# EAGLE design maho-messure (EAGLE 4.16)
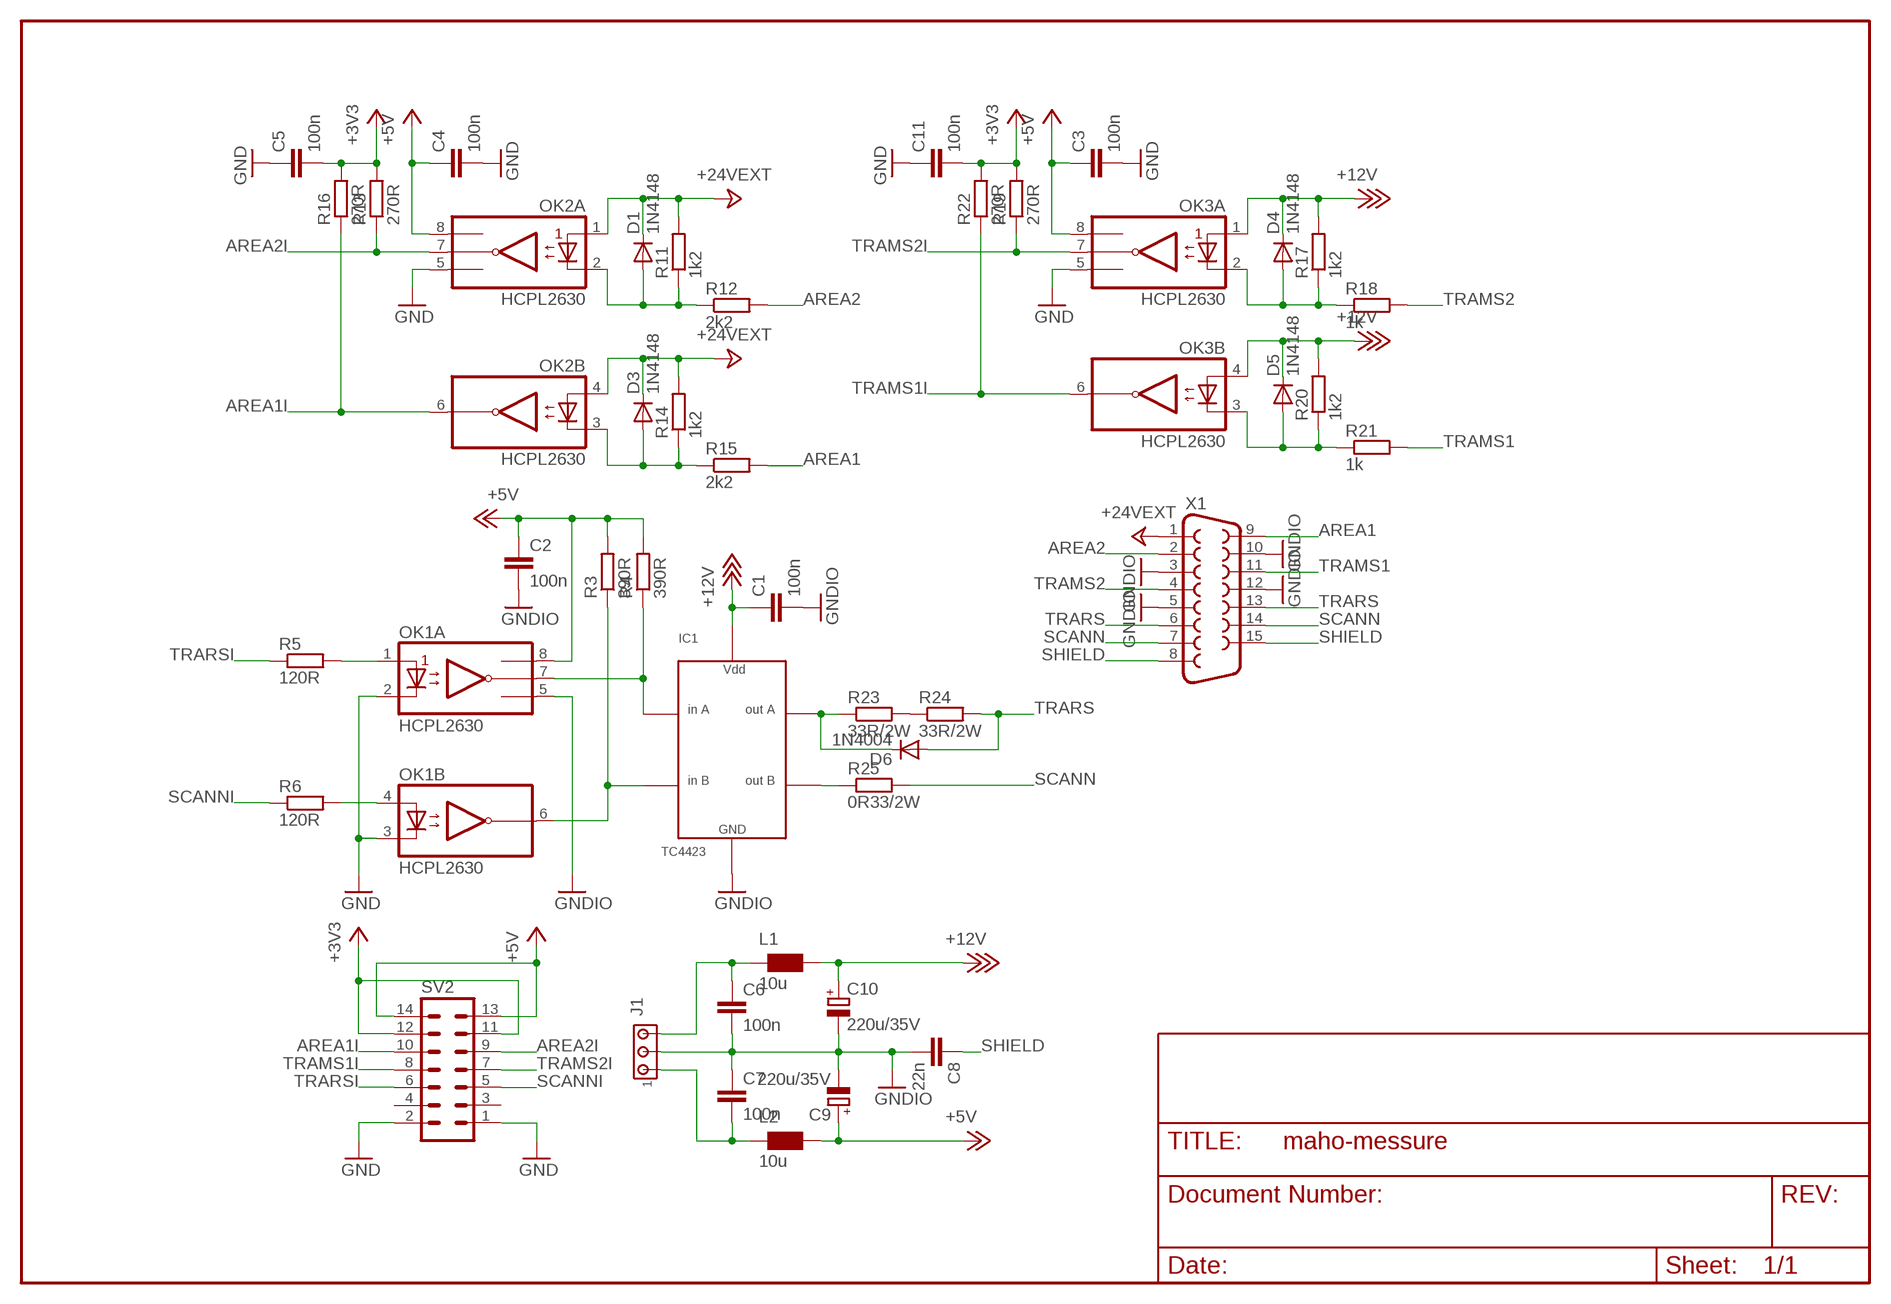
[diagram p0: schematic, sheet 1]

## Parts
C1  100n  C-EUC0603  [C0603]
C2  100n  C-EUC0603  [C0603]
C3  100n  C-EUC0603  [C0603]
C4  100n  C-EUC0603  [C0603]
C5  100n  C-EUC0603  [C0603]
C6  100n  C-EUC0603  [C0603]
C7  100n  C-EUC0603  [C0603]
C8  22n  C-EUC0603  [C0603]
C9  220u/35V  CPOL-EUF  [PANASONIC_F]
C10  220u/35V  CPOL-EUF  [PANASONIC_F]
C11  100n  C-EUC0603  [C0603]
D1  1N4148  DIODE-MINIMELF  [MINIMELF]
D3  1N4148  DIODE-MINIMELF  [MINIMELF]
D4  1N4148  DIODE-MINIMELF  [MINIMELF]
D5  1N4148  DIODE-MINIMELF  [MINIMELF]
D6  1N4004  ES2D  [SMB]
IC1  TC4423  TC442X  [SO08]
J1  MTA03-100  [10X03MTA]
L1  10u  WE-HC_744312...  [WE-HC_744312...]
L2  10u  WE-HC_744312...  [WE-HC_744312...]
OK1  HCPL2630  [DIL08]
OK2  HCPL2630  [DIL08]
OK3  HCPL2630  [DIL08]
R3  390R  R-EU_R0805  [R0805]
R4  390R  R-EU_R0805  [R0805]
R5  120R  R-EU_R0805  [R0805]
R6  120R  R-EU_R0805  [R0805]
R11  1k2  R-EU_R0805  [R0805]
R12  2k2  R-EU_R0805  [R0805]
R13  270R  R-EU_R0805  [R0805]
R14  1k2  R-EU_R0805  [R0805]
R15  2k2  R-EU_R0805  [R0805]
R16  270R  R-EU_R0805  [R0805]
R17  1k2  R-EU_R0805  [R0805]
R18  1k  R-EU_R0805  [R0805]
R19  270R  R-EU_R0805  [R0805]
R20  1k2  R-EU_R0805  [R0805]
R21  1k  R-EU_R0805  [R0805]
R22  270R  R-EU_R0805  [R0805]
R23  33R/2W  R-EU_R2512  [R2512]
R24  33R/2W  R-EU_R2512  [R2512]
R25  0R33/2W  R-EU_R2512  [R2512]
SV2  ML14  [ML14]
X1  F15HP  [F15HP]

## Nets
+3V3: C5.2 C11.2 R13.2 R16.2 R19.2 R22.2 SV2.11 SV2.12
+5V: C3.1 C4.1 OK2.8(A:VCC) OK3.8(A:VCC) SV2.13 SV2.14
+12V: C2.1 C9.+ L2.2 OK1.8(A:VCC) R3.2 R4.2 ; supply symbol labelled +5V
+18V: C1.1 C10.+ D4.C D5.C IC1.6(VDD) L1.2 OK3.1(A:A1) OK3.4(B:A2) R17.2 R20.2 ; supply symbol labelled +12V
+24V: D1.C D3.C OK2.1(A:A1) OK2.4(B:A2) R11.2 R14.2 X1.1 ; supply symbol labelled +24VEXT
AREA1: R15.2 X1.9
AREA1I: OK2.6(B:VO2) R16.1 SV2.10
AREA2: R12.2 X1.2
AREA2I: OK2.7(A:VO1) R13.1 SV2.9
GND: C3.2 C4.2 C5.1 C11.1 OK1.2(A:C1) OK1.3(B:C2) OK2.5(A:GND) OK3.5(A:GND) SV2.1 SV2.2
GNDIO: C1.2 C2.2 C6.2 C7.1 C8.2 C9.- C10.- IC1.3(GND) J1.2 OK1.5(A:GND) X1.3 X1.5 X1.10 X1.12
N$1: D6.C IC1.7(OUT_A) R23.1
N$2: IC1.5(OUT_B) R25.1
N$3: IC1.2(IN_A) OK1.7(A:VO1) R4.1
N$4: IC1.4(IN_B) OK1.6(B:VO2) R3.1
N$5: C7.2 J1.1 L2.1
N$6: OK1.1(A:A1) R5.2
N$7: OK1.4(B:A2) R6.2
N$9: D1.A OK2.2(A:C1) R11.1 R12.1
N$15: C6.1 J1.3 L1.1
N$16: D3.A OK2.3(B:C2) R14.1 R15.1
N$17: R23.2 R24.1
N$21: D4.A OK3.2(A:C1) R17.1 R18.1
N$24: D5.A OK3.3(B:C2) R20.1 R21.1
SCANN: R25.2 X1.7 X1.14
SCANNI: R6.1 SV2.5
SHIELD: C8.1 X1.8 X1.15
TRAMS1: R21.2 X1.11
TRAMS1I: OK3.6(B:VO2) R22.1 SV2.8
TRAMS2: R18.2 X1.4
TRAMS2I: OK3.7(A:VO1) R19.1 SV2.7
TRARS: D6.A R24.2 X1.6 X1.13
TRARSI: R5.1 SV2.6
Unconnected: SV2.3 SV2.4

## Library data of the parts
C1-C8 C11 = rcl:C-EU: CAPACITOR, European symbol
C9 C10 = rcl:CPOL-EU: POLARIZED CAPACITOR, European symbol
D1 D3-D5 = diode:DIODE-: DIODE
D6 = diode:ES2D: DIODE super fast rectifier, 2 A
IC1 = sascha_micro:TC442X
J1 = con-amp:MTA03-100: AMP connector
L1 L2 = wuerth-elektronik:WE-HC: SMD-Flat Wire Inductors WE-HC HIGH CURRENT Lower losses and no thermal aging because of the new advanced core material Superflux 200 - Flat wire coil for lower losses at high frequency ranges - Low leakage field - Extremely low profile design - Current loading up to 30 A -- Graphic cards -- Laptops -- Motherboards -- High current switching regulators -- Automotive electronics
OK1-OK3 = optocoupler:HCPL2630: HEWLETT PACKARD OPTO COUPLER
R3-R6 R11-R25 = rcl:R-EU_: RESISTOR, European symbol
SV2 = con-harting-ml:ML14: HARTING
X1 = con-subd:F15: SUB-D

## Board
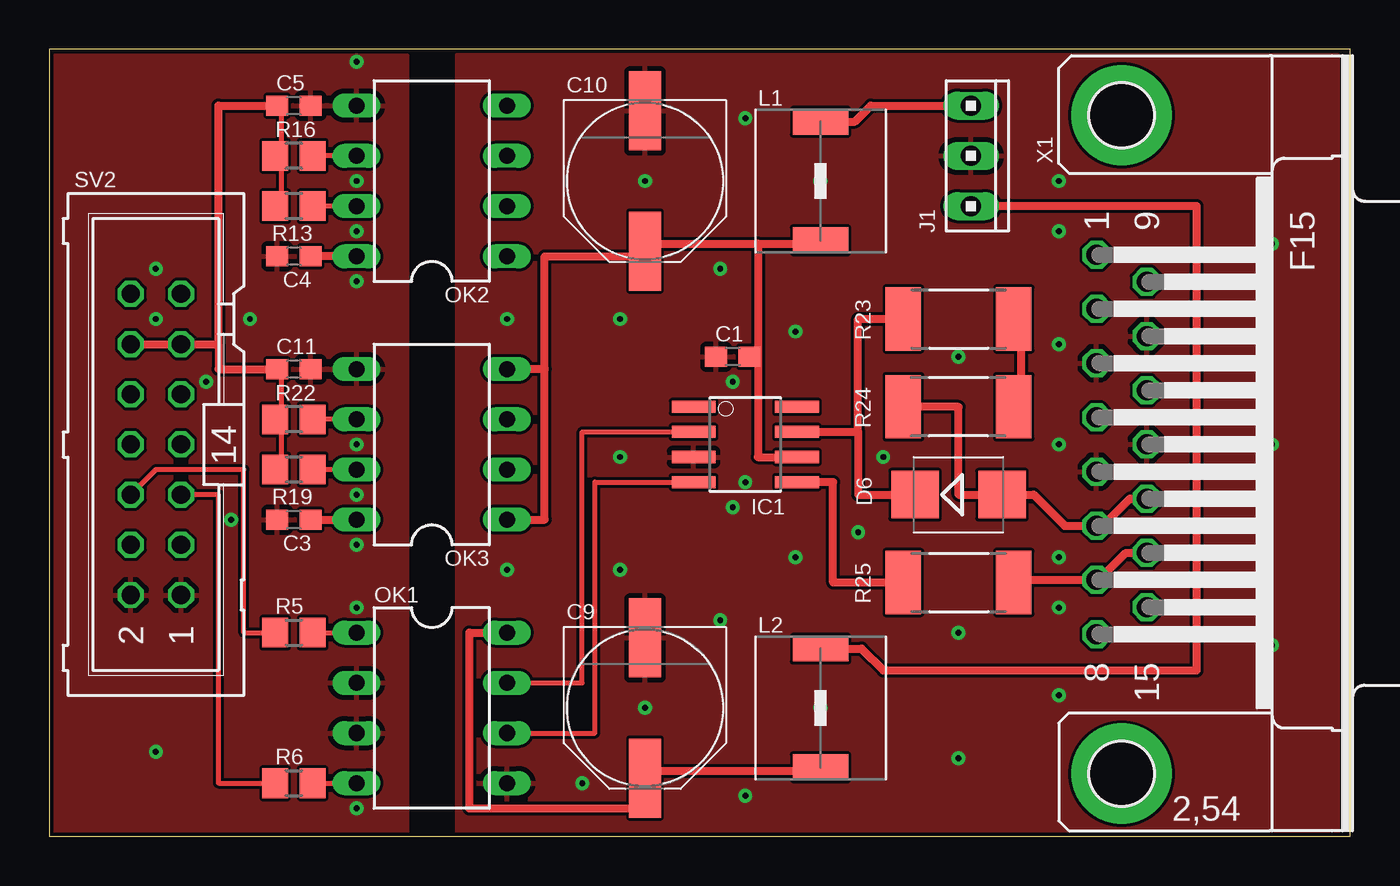
[diagram p1: board, top side]
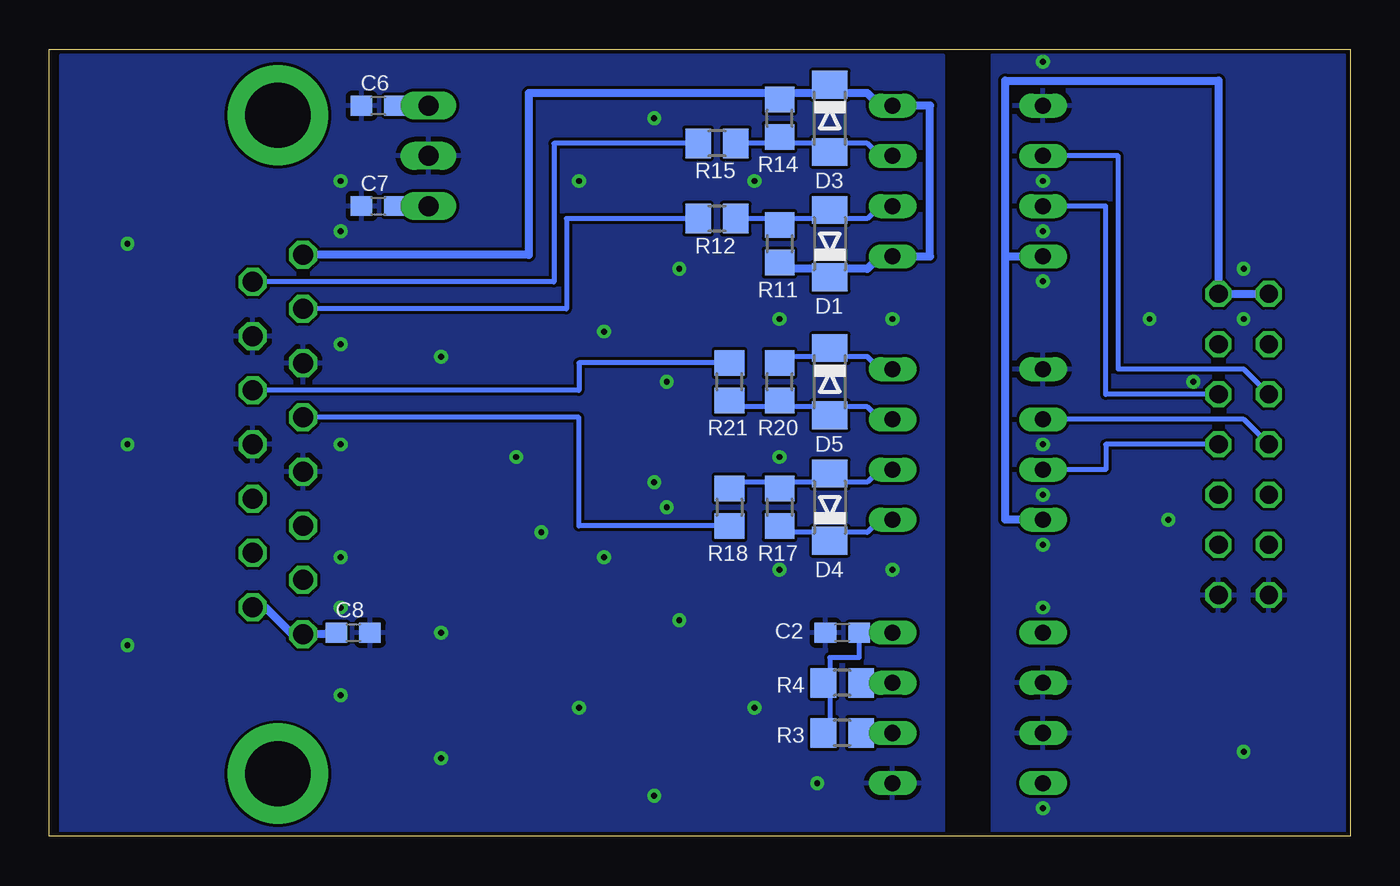
[diagram p2: board, bottom side, seen from below]

Size 65.86 x 39.83 mm. Coordinates in mm from the lower left corner, seen from the top.
Outline: 0,0 65.86,0 65.86,39.83 0,39.83 0,0
Copper layers (1+2*15+16): Top 0.035mm / dielectric 0.15mm / Route2 0.018mm / dielectric 1.5mm / Route15 0.018mm / dielectric 0.15mm / Bottom 0.035mm
Design rules "eurocircuits_class5": minimum track width 0.15mm, minimum drill 0.2mm, track to track 0.15mm, track to pad 0.15mm, pad to pad 0.15mm, via to via 0.15mm, smd to smd 0mil, copper to edge 0.2mm, drill to drill 0.2mm, minimum pad ring 0.2mm, minimum via ring 0.2mm, stop-mask expansion 4mil, vias tented up to drill 0mil, thermal gap 10mil

### Footprints (pad centres in the part's own frame; a part is rotated, then mirrored left to right if it is on the bottom)
C0603 = smd 1.1 x 1: 1 -0.85,0; 2 0.85,0
PANASONIC_F = smd 4 x 1.6: + 3.55,0; - -3.55,0
MINIMELF = smd 1.4 x 1.8: A 1.7,0; C -1.7,0
SMB = smd 2.4 x 2.4: A 2.2,0; C -2.2,0
SO08 = smd 0.61 x 2.21: 1 -1.905,-2.616; 2 -0.635,-2.616; 3 0.635,-2.616; 4 1.905,-2.616; 5 1.905,2.616; 6 0.635,2.616; 7 -0.635,2.616; 8 -1.905,2.616
10X03MTA = drill 1.016 long: 1 2.54,0; 2 0,0; 3 -2.54,0
WE-HC_744312... = smd 1.3 x 2.8: 1 -3,0; 2 3,0
DIL08 = drill 0.813 long: 1 -3.81,-3.81; 2 -1.27,-3.81; 3 1.27,-3.81; 4 3.81,-3.81; 5 3.81,3.81; 6 1.27,3.81; 7 -1.27,3.81; 8 -3.81,3.81
R0805 = smd 1.3 x 1.5: 1 -0.95,0; 2 0.95,0
R2512 = smd 1.8 x 3.2: 1 -2.8,0; 2 2.8,0
ML14 = drill 0.914 octagon: 1 -7.62,-1.27; 2 -7.62,1.27; 3 -5.08,-1.27; 4 -5.08,1.27; 5 -2.54,-1.27; 6 -2.54,1.27; 7 0,-1.27; 8 0,1.27; 9 2.54,-1.27; 10 2.54,1.27; 11 5.08,-1.27; 12 5.08,1.27; 13 7.62,-1.27; 14 7.62,1.27
F15HP = drill 1.016 octagon: 1 -9.601,-1.27; 2 -6.858,-1.27; 3 -4.115,-1.27; 4 -1.372,-1.27; 5 1.372,-1.27; 6 4.115,-1.27; 7 6.858,-1.27; 8 9.601,-1.27; 9 -8.23,1.27; 10 -5.486,1.27; 11 -2.743,1.27; 12 0,1.27; 13 2.743,1.27; 14 5.486,1.27; 15 8.23,1.27 | drill 3.302 pad 5.08 round: G1 -16.662,0; G2 16.662,0

### Placement (x,y rotation side)
C1  34.6,24.28 180 top
C2  25.71,10.31 180 bottom
C3  12.38,16.03 180 top
C4  12.38,29.36 180 top
C5  12.38,36.98 180 top
C6  49.21,36.98 180 bottom
C7  49.21,31.9 0 bottom
C8  50.48,10.31 0 bottom
C9  30.16,6.5 270 top
C10  30.16,33.17 270 top
C11  12.38,23.65 180 top
D1  26.35,30 90 bottom
D3  26.35,36.35 270 bottom
D4  26.35,16.66 90 bottom
D5  26.35,23.01 270 bottom
D6  46.03,17.3 0 top
IC1  35.24,19.84 270 top
J1  46.67,34.44 270 top
L1  39.05,33.17 270 top
L2  39.05,6.5 270 top
OK1  19.36,6.5 270 top
OK2  19.36,33.17 90 top
OK3  19.36,19.84 90 top
R3  25.71,5.23 180 bottom
R4  25.71,7.77 180 bottom
R5  12.38,10.31 0 top
R6  12.38,2.69 0 top
R11  28.89,30 270 bottom
R12  32.06,31.27 180 bottom
R13  12.38,31.9 180 top
R14  28.89,36.35 90 bottom
R15  32.06,35.08 180 bottom
R16  12.38,34.44 180 top
R17  28.89,16.66 270 bottom
R18  31.43,16.66 270 bottom
R19  12.38,18.57 180 top
R20  28.89,23.01 90 bottom
R21  31.43,23.01 90 bottom
R22  12.38,21.11 180 top
R23  46.03,26.19 0 top
R24  46.03,21.74 180 top
R25  46.03,12.85 0 top
SV2  5.39,19.84 90 top
X1  54.29,19.84 270 top

### Tracks (layer width: path | path; a pad name or v marks a point on that pad's centre or on a via)
+3V3
  Top 0.254: 11.74,23.65 11.74,21.11 | 11.74,21.11 R22.2 | R19.2 11.74,18.57 11.74,21.11 | R13.2 11.74,31.9 11.74,34.44 | 11.74,34.44 R16.2 | 11.74,36.98 11.74,34.44
  Top 0.406: SV2.12 SV2.11 8.57,24.92 | C11.2 11.74,23.65 8.57,23.65 8.57,24.92 | 8.57,24.92 8.57,36.98 C5.2 11.74,36.98
+5V
  Top 0.406: OK2.8 C4.1 | C3.1 OK3.8
  Bottom 0.406: 17.46,29.36 17.46,16.03 OK3.8 | 17.46,29.36 17.46,38.25 6.66,38.25 SV2.13 SV2.14 | 17.46,29.36 OK2.8
+12V
  Top 0.406: L2.2 39.05,3.33 30.16,3.33 C9.+ 30.16,1.42 21.27,1.42 21.27,10.31 OK1.8
  Bottom 0.254: C2.1 24.86,9.04 26.35,9.04 26.35,7.77 | 26.35,7.77 R4.2 | R3.2 26.35,5.23 26.35,7.77
  Bottom 0.406: OK1.8 C2.1
+18V
  Top 0.254: 35.87,24.28 C1.1
  Top 0.406: L1.2 39.05,30 35.87,30 | 35.87,30 30.16,30 C10.+ 30.16,29.36 25.08,29.36 25.08,23.65 | IC1.6 35.87,19.2 35.87,24.28 35.87,30 | 25.08,23.65 OK3.4 | OK3.1 25.08,16.03 25.08,23.65
  Bottom 0.254: OK3.4 23.81,23.65 24.44,24.28 26.35,24.28 | OK3.1 23.81,16.03 24.44,15.39 26.35,15.39 | 26.35,24.28 D5.C | R20.2 28.89,24.28 26.35,24.28 | R17.2 28.89,15.39 26.35,15.39 | 26.35,15.39 D4.C
+24V
  Bottom 0.406: X1.1 41.59,29.44 41.59,37.62 28.89,37.62 | 26.35,37.62 24.44,37.62 23.81,36.98 OK2.4 21.27,36.98 21.27,29.36 OK2.1 23.81,29.36 24.44,28.73 26.35,28.73 | 28.89,37.62 R14.2 | 26.35,37.62 D3.C | 26.35,37.62 28.89,37.62 | R11.2 28.89,28.73 26.35,28.73 | 26.35,28.73 D1.C
AREA1
  Bottom 0.254: X1.9 40.32,28.07 40.32,35.08 R15.2
AREA1I
  Top 0.254: OK2.6 R16.1
  Bottom 0.254: OK2.6 11.74,34.44 11.74,23.65 5.39,23.65 SV2.10
AREA2
  Bottom 0.254: X1.2 39.68,26.7 39.68,31.27 R12.2
AREA2I
  Top 0.254: OK2.7 R13.1
  Bottom 0.254: OK2.7 12.38,31.9 12.38,22.38 SV2.9
GND  (via drill 0.3)
  other vias: 15.55,14.76 15.55,19.84 15.55,1.42 15.55,28.09 15.55,39.2 15.55,33.17 15.55,30.63 15.55,17.3 15.55,11.58 9.2,16.03 5.39,26.19 5.39,28.73 5.39,4.28 10.16,26.19 7.93,23.01
  pour Bottom: 0.31,39.52 18.09,39.52 18.09,0.15 0.31,0.15
  pour Top: 0.31,39.52 18.09,39.52 18.09,0.15 0.31,0.15
GNDIO  (via drill 0.3)
  other vias: 51.11,19.84 51.11,7.14 51.11,30.63 51.11,33.17 51.11,24.92 51.11,14.12 51.11,11.58 46.03,3.96 46.03,10.31 39.05,33.17 30.16,33.17 35.24,36.35 33.97,28.73 37.78,25.55 35.24,17.93 34.6,23.01 28.89,26.19 23.17,26.19 23.17,13.49 28.89,13.49 28.89,19.2 33.97,10.95 37.78,14.12 34.6,16.66 40.95,15.39 42.22,19.2 46.03,24.28 35.24,2.06 26.98,2.69 30.16,6.5 39.05,6.5 61.91,19.84 61.91,30 61.91,9.68
  pour Bottom: 20.63,39.52 20.63,0.15 65.24,0.15 65.24,39.52
  pour Top: 20.63,39.52 20.63,0.15 65.24,0.15 65.24,39.52
N$1
  Top 0.406: IC1.7 40.95,20.47 | 40.95,20.47 40.95,26.19 R23.1 | D6.C 40.95,17.3 40.95,20.47
N$2
  Top 0.406: IC1.5 39.68,17.93 39.68,12.85 R25.1
N$3
  Top 0.254: IC1.2 26.98,20.47 26.98,7.77 OK1.7
  Bottom 0.254: OK1.7 R4.1
N$4
  Top 0.254: IC1.4 27.62,17.93 27.62,5.23 OK1.6
  Bottom 0.254: OK1.6 R3.1
N$5
  Top 0.406: J1.1 58.1,31.9 58.1,8.41 42.22,8.41 41.13,9.5 L2.1
  Bottom 0.406: J1.1 C7.2
N$6
  Top 0.254: R5.2 OK1.1
N$7
  Top 0.254: R6.2 OK1.4
N$9
  Bottom 0.254: OK2.2 23.81,31.9 24.44,31.27 26.35,31.27 | 26.35,31.27 D1.A | 26.35,31.27 28.89,31.27 | 28.89,31.27 R11.1 | 28.89,31.27 R12.1
N$15
  Top 0.406: L1.1 40.78,36.17 41.59,36.98 J1.3
  Bottom 0.406: J1.3 C6.1
N$16
  Bottom 0.254: OK2.3 23.81,34.44 24.44,35.08 26.35,35.08 | 26.35,35.08 D3.A | 26.35,35.08 28.89,35.08 | 28.89,35.08 R14.1 | 28.89,35.08 R15.1
N$17
  Top 0.406: R24.1 49.21,21.74 49.21,26.19 R23.2
N$21
  Bottom 0.254: OK3.2 23.81,18.57 24.44,17.93 26.35,17.93 | 26.35,17.93 D4.A | 26.35,17.93 28.89,17.93 | 28.89,17.93 R17.1 | R18.1 31.43,17.93 28.89,17.93
N$24
  Bottom 0.254: OK3.3 23.81,21.11 24.44,21.74 26.35,21.74 | 26.35,21.74 D5.A | 26.35,21.74 28.89,21.74 | 28.89,21.74 R20.1 | R21.1 31.43,21.74 28.89,21.74
SCANN
  Top 0.406: X1.14 54.52,14.35 53.14,12.98 X1.7 49.34,12.98 49.21,12.85 R25.2
SCANNI
  Top 0.254: SV2.5 8.57,17.3 8.57,2.69 R6.1
SHIELD
  Bottom 0.406: X1.15 54.95,11.61 53.58,10.24 X1.8 51.75,10.24 51.75,10.31 C8.1
TRAMS1
  Bottom 0.254: R21.2 39.05,23.96 39.05,22.58 X1.11
TRAMS1I
  Top 0.254: OK3.6 R22.1
  Bottom 0.254: OK3.6 5.39,21.11 SV2.8
TRAMS2
  Bottom 0.254: X1.4 39.05,21.21 39.05,15.71 R18.2
TRAMS2I
  Top 0.254: OK3.7 R19.1
  Bottom 0.254: OK3.7 12.38,18.57 12.38,19.84 SV2.7
TRARS
  Top 0.406: X1.13 54.72,17.09 53.35,15.72 X1.6 51.42,15.72 49.84,17.3 D6.A 46.03,17.3 46.03,21.74 R24.2
TRARSI
  Top 0.254: SV2.6 5.39,18.57 9.84,18.57 9.84,10.31 R5.1